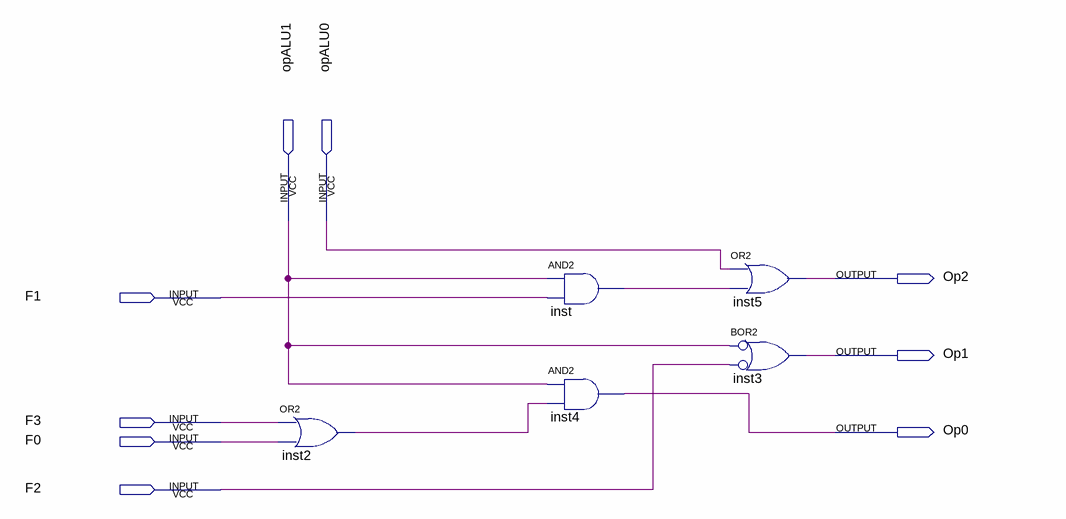
[diagram p0: schematic sheet]
// Quartus schematic ControleALU.bdf as structural Verilog: 5 symbols, 9 pins
module ControleALU (
  input  opALU1,
  input  opALU0,
  input  F1,
  input  F3,
  input  F0,
  input  F2,
  output Op2,
  output Op1,
  output Op0
);

  wire inst2_out, inst_out;

  or inst2 (inst2_out, F3, F0);
  and inst (inst_out, opALU1, F1);
  and inst4 (Op0, opALU1, inst2_out);
  or inst5 (Op2, opALU0, inst_out);
  or inst3 (Op1, ~opALU1, ~F2);  // BOR2
endmodule
